# EAGLE design Deckelplatine v091 (EAGLE 7.2.0)
AUTHOR: Stefan Müller; DATABASE: /home/smueller/eagle/_parts-database.txt.csv; PARTNO: SMD-0603 2,2K; PROJEKTNAME: xMZ-Mod-Touch-Deckelplatine; REV: A; VERSION: 0.9.1
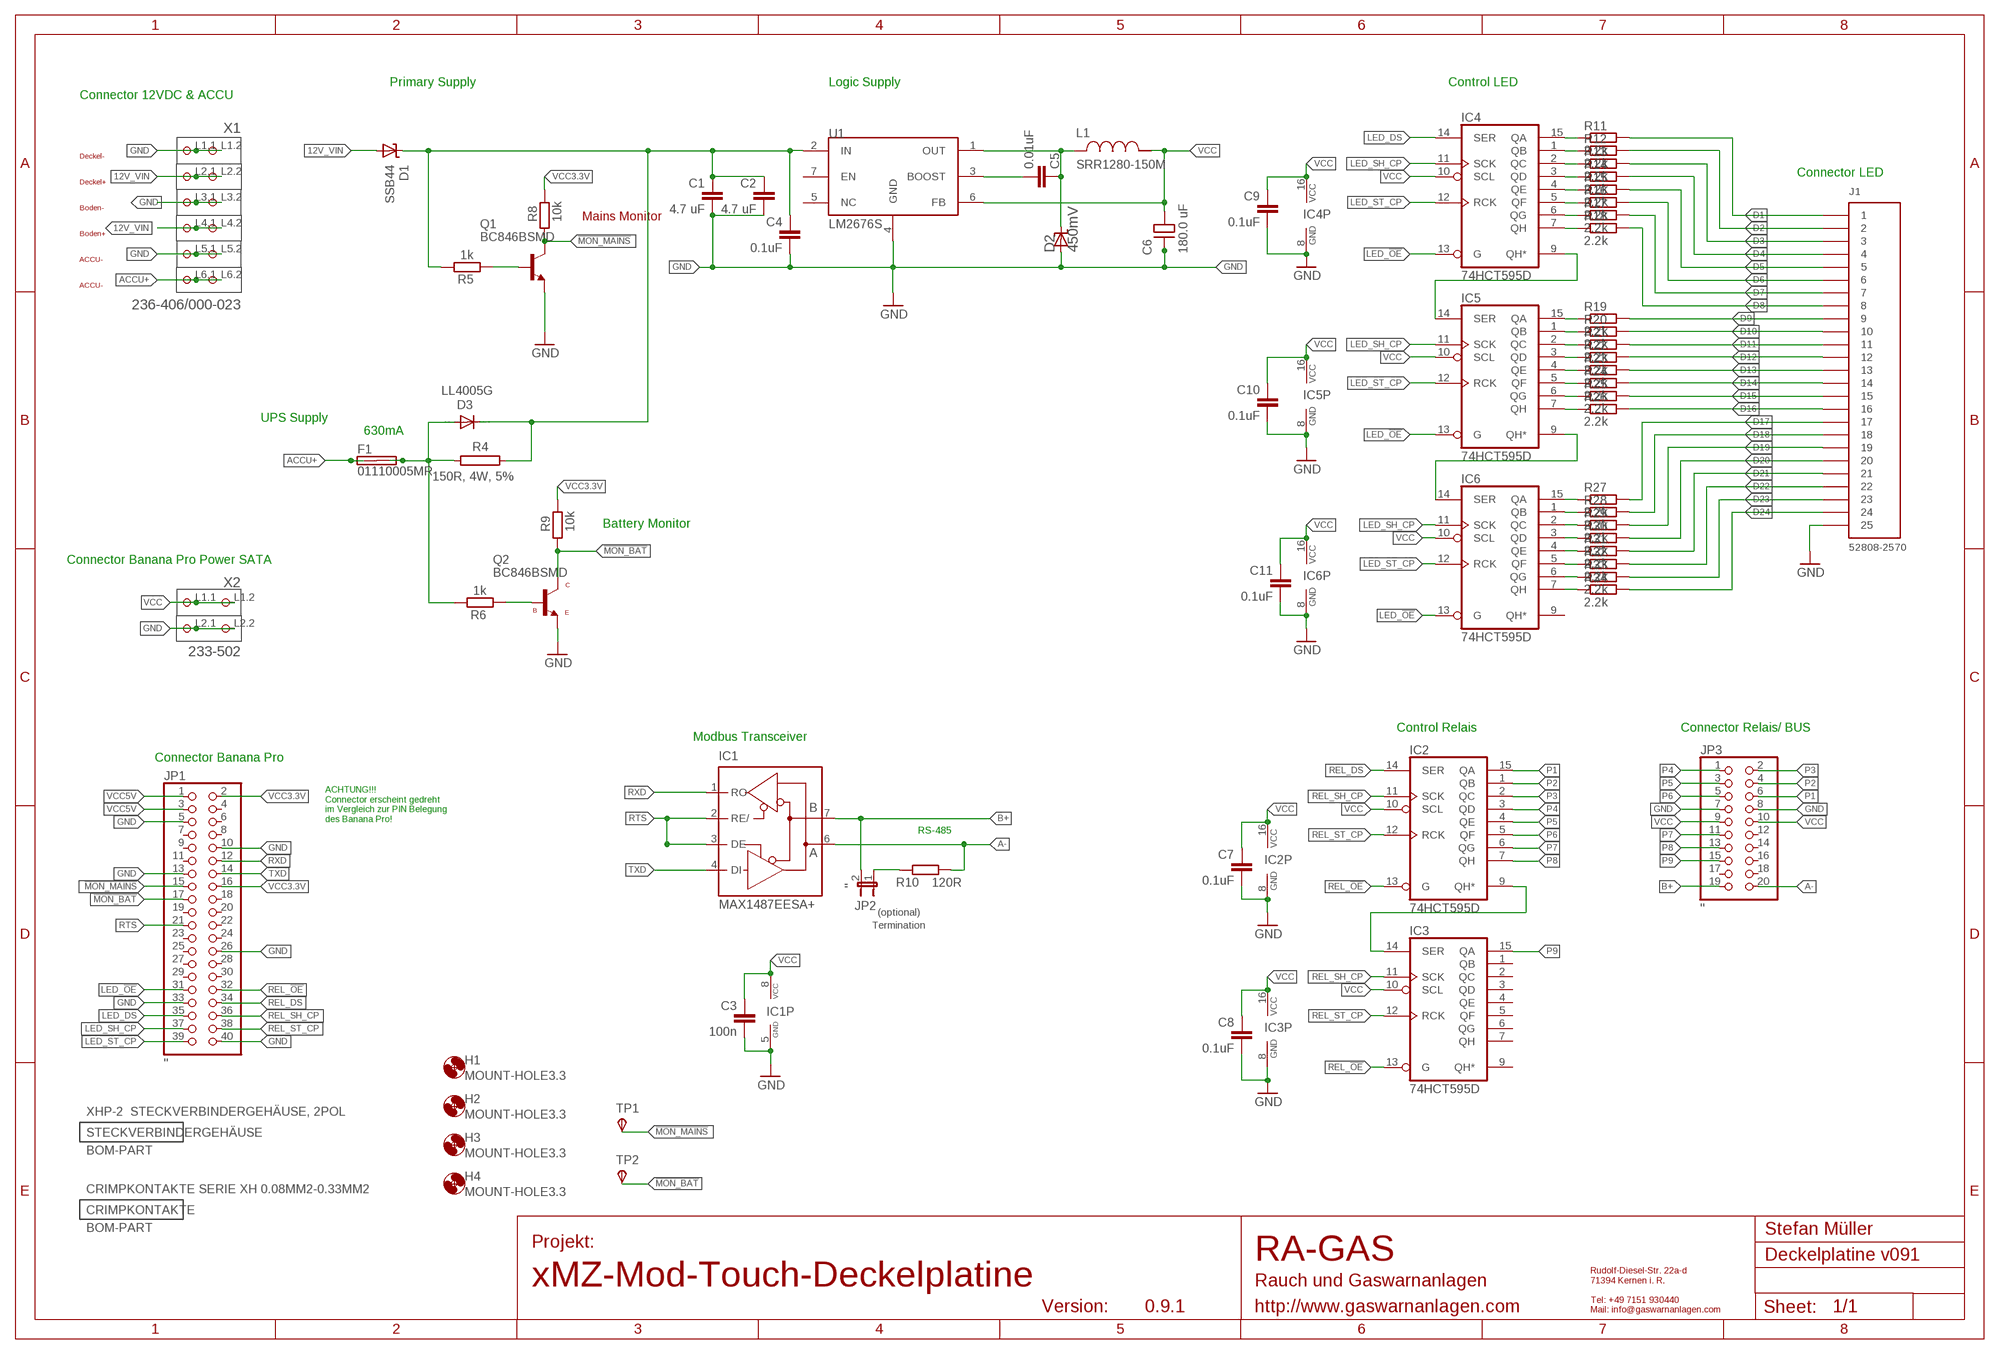
[diagram p0: schematic, sheet 1]
CRIMPKONTAKTE (BOM-PART): BOM: INCLUDE; DESC: CRIMPKONTAKTE SERIE XH 0.08MM2-0.33MM2; OC_FARNELL: 1516301; PARTNO: CRIMPKONTAKTE; QTY: 2
STECKVERBINDERGEHÄUSE (BOM-PART): BOM: INCLUDE; DESC: XHP-2 STECKVERBINDERGEHÄUSE, 2POL; OC_FARNELL: 1516264; PARTNO: 1516264; QTY: 1

## Parts
C1  4.7 uF  GRM21BR61E475MA12L  [GRM21BR61E475MA12L]
C2  4.7 uF  GRM21BR61E475MA12L  [GRM21BR61E475MA12L]
C3  100n  C-EUC0603  [C0603]
C4  0.1uF  08053C104KAT2A  [0805]
C5  0.01uF  GRM216R71H103KA01D  [GRM216R71H103KA01D]
C6  180.0 uF  16SVP180MSM_RADIAL_10MM  [SM_RADIAL_10MM]
C7  0.1uF  C-EUC0603  [C0603]
C8  0.1uF  C-EUC0603  [C0603]
C9  0.1uF  C-EUC0603  [C0603]
C10  0.1uF  C-EUC0603  [C0603]
C11  0.1uF  C-EUC0603  [C0603]
D1  SSB44  SUPPRESSOR-SMBJ  [SMBJ]
D2  450mV  B340LB-13-F  [SMB]
D3  LL4005G  DIODE-MELF-MLL41  [MELF-MLL41]
F1  01110005MR  [01110005MR]
H1  MOUNT-HOLE3.3  [3,3]
H2  MOUNT-HOLE3.3  [3,3]
H3  MOUNT-HOLE3.3  [3,3]
H4  MOUNT-HOLE3.3  [3,3]
IC1  MAX1487EESA+  MAX481CSA  [SO08]
IC2  74HCT595D  [SO16]
IC3  74HCT595D  [SO16]
IC4  74HCT595D  [SO16]
IC5  74HCT595D  [SO16]
IC6  74HCT595D  [SO16]
J1  52808-2570  [52808-2570]
JP1  ''  PINHD-2X20  [2X20]
JP2  ''  JP1E  [JP1]
JP3  ''  PINHD-2X10  [2X10]
L1  SRR1280-150M  [SRR1280]
Q1  BC846BSMD  [SOT23]
Q2  BC846BSMD  [SOT23]
R4  150R, 4W, 5%  RKH206-8  [KH206-8]
R5  1k  R-EU_R1210  [R1210]
R6  1k  R-EU_R1210  [R1210]
R8  10k  R-EU_R1210  [R1210]
R9  10k  R-EU_R1210  [R1210]
R10  120R  R-EU_R1206  [R1206]
R11  2.2k  R-EU_R0603  [R0603]
R12  2.2k  R-EU_R0603  [R0603]
R13  2.2k  R-EU_R0603  [R0603]
R14  2.2k  R-EU_R0603  [R0603]
R15  2.2k  R-EU_R0603  [R0603]
R16  2.2k  R-EU_R0603  [R0603]
R17  2.2k  R-EU_R0603  [R0603]
R18  2.2k  R-EU_R0603  [R0603]
R19  2.2k  R-EU_R0603  [R0603]
R20  2.2k  R-EU_R0603  [R0603]
R21  2.2k  R-EU_R0603  [R0603]
R22  2.2k  R-EU_R0603  [R0603]
R23  2.2k  R-EU_R0603  [R0603]
R24  2.2k  R-EU_R0603  [R0603]
R25  2.2k  R-EU_R0603  [R0603]
R26  2.2k  R-EU_R0603  [R0603]
R27  2.2k  R-EU_R0603  [R0603]
R28  2.2k  R-EU_R0603  [R0603]
R29  2.2k  R-EU_R0603  [R0603]
R30  2.2k  R-EU_R0603  [R0603]
R31  2.2k  R-EU_R0603  [R0603]
R32  2.2k  R-EU_R0603  [R0603]
R33  2.2k  R-EU_R0603  [R0603]
R34  2.2k  R-EU_R0603  [R0603]
TP1  TPSB1,27  [B1,27]
TP2  TPSB1,27  [B1,27]
U1  LM2676S  [TO-263-7]
X1  236-406/000-023  [P-236-406]
X2  233-502  [P-233-502]

## Nets
12V_VIN: C1.1 C2.1 C4.1 D1.A D1.C D3.C R4.2 R5.2 U1.2(IN) X1.L2.1(P2.1) X1.L2.2(P2.2) X1.L4.1(P4.1) X1.L4.2(P4.2)
!MON_BAT: JP1.17 Q2.3(C) R9.1 TP2.TP(PP)
!MON_MAINS: JP1.15 Q1.3(C) R8.1 TP1.TP(PP)
A-: IC1.6(A) JP3.20 R10.2
ACCU+: D3.A F1.1A F1.1B F1.2A F1.2B R4.1 R6.2 X1.L6.1(P6.1) X1.L6.2(P6.2)
B+: IC1.7(B) JP2.2 JP3.19
D1: J1.1 R11.2
D2: J1.2 R12.2
D3: J1.3 R13.2
D4: J1.4 R14.2
D5: J1.5 R15.2
D6: J1.6 R16.2
D7: J1.7 R17.2
D8: J1.8 R18.2
D9: J1.9 R19.2
D10: J1.10 R20.2
D11: J1.11 R21.2
D12: J1.12 R22.2
D13: J1.13 R23.2
D14: J1.14 R24.2
D15: J1.15 R25.2
D16: J1.16 R26.2
D17: J1.17 R27.2
D18: J1.18 R28.2
D19: J1.19 R29.2
D20: J1.20 R30.2
D21: J1.21 R31.2
D22: J1.22 R32.2
D23: J1.23 R33.2
D24: J1.24 R34.2
GND: C1.2 C2.2 C3.2 C4.2 C6.2(-) C7.2 C8.2 C9.2 C10.2 C11.2 D2.A IC1.5(GND) IC2.8(GND) IC3.8(GND) IC4.8(GND) IC5.8(GND) IC6.8(GND) J1.25 JP1.5 JP1.10 JP1.13 JP1.26 JP1.33 JP1.40 JP3.7 JP3.8 Q1.2(E) Q2.2(E) U1.4(GND) X1.L1.1(P1.1) X1.L1.2(P1.2) X1.L3.1(P3.1) X1.L3.2(P3.2) X1.L5.1(P5.1) X1.L5.2(P5.2) X2.L2.1(P2.1) X2.L2.2(P2.2)
LED_!OE: IC4.13(G) IC5.13(G) IC6.13(G) JP1.31
LED_DS: IC4.14(SER) JP1.35
LED_SH_CP: IC4.11(SCK) IC5.11(SCK) IC6.11(SCK) JP1.37
LED_ST_CP: IC4.12(RCK) IC5.12(RCK) IC6.12(RCK) JP1.39
N$2: IC5.9(QH*) IC6.14(SER)
N$3: IC2.9(QH*) IC3.14(SER)
N$4: Q2.1(B) R6.1
N$5: IC4.9(QH*) IC5.14(SER)
N$6: IC4.15(QA) R11.1
N$7: IC4.1(QB) R12.1
N$8: IC4.2(QC) R13.1
N$9: IC4.3(QD) R14.1
N$10: IC4.4(QE) R15.1
N$11: IC4.5(QF) R16.1
N$12: IC4.6(QG) R17.1
N$13: IC4.7(QH) R18.1
N$14: IC5.15(QA) R19.1
N$15: IC5.1(QB) R20.1
N$16: IC5.2(QC) R21.1
N$17: IC5.3(QD) R22.1
N$18: JP2.1 R10.1
N$19: IC5.4(QE) R23.1
N$20: IC5.5(QF) R24.1
N$21: IC5.6(QG) R25.1
N$22: IC5.7(QH) R26.1
N$23: IC6.15(QA) R27.1
N$24: IC6.1(QB) R28.1
N$25: IC6.2(QC) R29.1
N$26: IC6.3(QD) R30.1
N$27: IC6.4(QE) R31.1
N$28: IC6.5(QF) R32.1
N$29: IC6.6(QG) R33.1
N$30: IC6.7(QH) R34.1
N$37: Q1.1(B) R5.1
N$42: C5.2 U1.3(BOOST)
N$44: C5.1 D2.C L1.1 U1.1(OUT)
P1: IC2.15(QA) JP3.6
P2: IC2.1(QB) JP3.4
P3: IC2.2(QC) JP3.2
P4: IC2.3(QD) JP3.1
P5: IC2.4(QE) JP3.3
P6: IC2.5(QF) JP3.5
P7: IC2.6(QG) JP3.11
P8: IC2.7(QH) JP3.13
P9: IC3.15(QA) JP3.15
REL_!OE: IC2.13(G) IC3.13(G) JP1.32
REL_DS: IC2.14(SER) JP1.34
REL_SH_CP: IC2.11(SCK) IC3.11(SCK) JP1.36
REL_ST_CP: IC2.12(RCK) IC3.12(RCK) JP1.38
RTS: IC1.2(RE/) IC1.3(DE) JP1.21
RXD: IC1.1(RO) JP1.12
TXD: IC1.4(DI) JP1.14
VCC: C3.1 C6.1(+) C7.1 C8.1 C9.1 C10.1 C11.1 IC1.8(VCC) IC2.10(SCL) IC2.16(VCC) IC3.10(SCL) IC3.16(VCC) IC4.10(SCL) IC4.16(VCC) IC5.10(SCL) IC5.16(VCC) IC6.10(SCL) IC6.16(VCC) JP3.9 JP3.10 L1.2 U1.6(FB) X2.L1.1(P1.1) X2.L1.2(P1.2)
VCC3.3V: JP1.2 JP1.16 R8.2 R9.2
VCC5V: JP1.1 JP1.3
Unconnected: IC3.1(QB) IC3.2(QC) IC3.3(QD) IC3.4(QE) IC3.5(QF) IC3.6(QG) IC3.7(QH) IC3.9(QH*) IC6.9(QH*) JP1.4 JP1.6 JP1.7 JP1.8 JP1.9 JP1.11 JP1.18 JP1.19 JP1.20 JP1.22 JP1.23 JP1.24 JP1.25 JP1.27 JP1.28 JP1.29 JP1.30 JP3.12 JP3.14 JP3.16 JP3.17 JP3.18 U1.5(NC) U1.7(EN)

## Notes on the sheet
- Primary Supply | Logic Supply | Control LED
- Connector 12VDC & ACCU
- Deckel-
- Connector LED
- Deckel+
- Boden-
- Mains Monitor
- Boden+
- ACCU-
- ACCU-
- UPS Supply
- 630mA
- Battery Monitor
- Connector Banana Pro Power SATA
- C
- B
- E
- Control Relais | Connector Relais/ BUS
- Modbus Transceiver
- Connector Banana Pro
- ACHTUNG!!!
  Connector erscheint gedreht
  im Vergleich zur PIN Belegung 
  des Banana Pro!
- RS-485
- (optional)
- Termination

## Library data of the parts
C1 C2 = AcceleratedDesigns_Lib:GRM21BR61E475MA12L; CAP: 4.7E-6; DATASHEETURL: http://www.murata.com/products/catalog/pdf/c02e.pdf; ESR: 0.0020; IRMS: 7.29; MANUFACTURER_PART_NUMBER: GRM21BR61E475MA12L; MF: MURATA; MPN: GRM21BR61E475MA12L; OC_FARNELL: 2362111; VDC: 25.0; VENDOR: MuRata
C3 = resistor:C-EU: CAPACITOR, European symbol; MF: KEMET; MPN: C0603C104K8RACTU; OC_FARNELL: 2112833; PARTNO: ECHU-16-100N
C4 = AcceleratedDesigns_Lib:08053C104KAT2A; CAP: 1.0E-7; ESR: 0.28; IRMS: 0.0; MANUFACTURER_PART_NUMBER: 08053C104KAT2A; MF: AVX; MPN: 08053C104KAT2A; OC_FARNELL: 1740665; VDC: 25.0; VENDOR: AVX
C5 = AcceleratedDesigns_Lib:GRM216R71H103KA01D; CAP: 1.0E-8; ESR: 0.0; IRMS: 0.0; MANUFACTURER_PART_NUMBER: GRM216R71H103KA01D; MF: MURATA; MPN: GRM216R71H103KA01D; OC_FARNELL: 1828948; VDC: 50.0; VENDOR: MuRata
C6 = AcceleratedDesigns_Lib:16SVP180M; MF: PANASONIC ELECTRONIC COMPONENTS; MPN: 16SVP180MX; OC_FARNELL: 2354685; PARTNO: RAD FC 560/35
C7-C11 = resistor:C-EU: CAPACITOR, European symbol; MF: KEMET; MPN: C0603C104K8RACTU; OC_FARNELL: 2112833; PARTNO: SMD TAN.0,1/35
D1 = diode:SUPPRESSOR-: Suppressor diode; MF: VISHAY; MPN: SSB44-E3/52T; OC_FARNELL: 1336557
D2 = AcceleratedDesigns_Lib:B340LB-13-F; DATASHEETURL: http://www.diodes.com/datasheets/ds30240.pdf; IO: 3.0; MANUFACTURER_PART_NUMBER: B340LB-13-F; MF: DIODES INC.; MPN: B340LB-13-F; OC_FARNELL: 1843684; VENDOR: Diodes Inc.; VFATIO: 0.45; VRRM: 40.0
D3 = diode:DIODE-: DIODE; MF: TAIWAN SEMICONDUCTOR; MPN: LL4005G; OC_FARNELL: 1625106
F1 = fuse-littlefuse:01110005MR: Fuse Holder For 5mm Diameter Fuses Automatic Insertion Type From Littelfuse CatalogNumber: 0111 0005MR Farnell <http://de.farnell.com/webapp/wcs/stores/servlet/Search?catalogId=15001&langId=-3&storeId=10161&gs=true&st=0111%200005MR>; MF: LITTELFUSE; MPN: 01110005MR; OC_FARNELL: 1155771; OC_FARNELL_ALTERNATIVE: 01110005MR
H1-H4 = holes:MOUNT-HOLE: MOUNTING HOLE with drill center marker; OC_FARNELL: unknown
IC1 = maxim:MAX481CSA: RS485 TRANSEIVER; MF: MAXIM INTEGRATED PRODUCTS; MPN: MAX1487EESA+; OC_FARNELL: 1593310; OC_NEWARK: 90C3817; PARTNO: MAX481CSA
IC2-IC6 = RA-GAS Projekte LTD:74*595: 8-bit SHIFT REGISTER, output latch; MF: NXP; MPN: 74HCT595D; OC_FARNELL: 2098004; PARTNO: SMD HC 595
J1 = RA-GAS Projekte LTD:52808-2570: Molex 25pin header Series 52808. 1.00mm Pitch Easy-On™ Type FFC/FPC Connector, Surface Mount, Vertical, Non-ZIF Receptacle, 25 Circuits More Information here: http://www.molex.com/molex/products/datasheet.jsp?part=active/0528082570_FFC_FPC_CONNECTORS.xml Farnell Order Code (OC_FARNELL): 1757123 http://uk.farnell.com/molex/52808-2570/connector-fpc-1-0mm-25way/dp/1757123; MF: MOLEX; MPN: 52808-2570; OC_FARNELL: 1757123
JP1 = pinhead:PINHD-2X20: PIN HEADER; DNP: T; MF: HARWIN; MPN: M20-6112045; OC_FARNELL: 1569232; OC_FARNELL_ALTERNATIVE: 1569230
JP2 = jumper:JP1E: JUMPER; MF: TE CONNECTIVITY / AMP; MPN: 825433-2; OC_FARNELL: 3417645
JP3 = pinhead:PINHD-2X10: PIN HEADER; DNP: T; MF: TE CONNECTIVITY / AMP; MPN: 5103308-5; OC_FARNELL: 2452432; OC_FARNELL_ALTERNATIV: 9689621
L1 = AcceleratedDesigns_Lib:SRR1280-150M; DCR: 0.0285; IDC: 5.0; L: 1.5E-5; MANUFACTURER_PART_NUMBER: SRR1280-150M; MF: COILCRAFT; MPN: MSS1278-153MLD; OC_FARNELL: 2288501; VENDOR: Bourns
Q1 Q2 = transistor-npn:BC846*: NPN Transistor; MF: NXP; MPN: BC846,215; OC_FARNELL: 1081227
R4 = resistor-power:R: Power Resitor; MF: TE CONNECTIVITY / CGS; MPN: ER74150RJT; OC_FARNELL: 1751842; OC_FARNELL_ALTERNATIVE: 1219280; OC_NEWARK: unknown
R5 R6 = rcl:R-EU_: RESISTOR, European symbol; MF: PANASONIC ELECTRONIC COMPONENTS; MPN: ERJP14F1001U; OC_FARNELL: 1750918
R8 R9 = rcl:R-EU_: RESISTOR, European symbol; MF: PANASONIC ELECTRONIC COMPONENTS; MPN: ERJP14F1002U; OC_FARNELL: 1750931
R10 = rcl:R-EU_: RESISTOR, European symbol; MF: TE CONNECTIVITY; MPN: CRGH1206F120R; OC_FARNELL: 2332128
R11-R34 = RA-GAS Projekte LTD:R-EU_: RESISTOR, European symbol; MF: YAGEO (PHYCOMP); MPN: RC0603FR-072K2L; OC_FARNELL: 9238522; PARTNO: SMD-0603 2,2K
TP1 TP2 = testpad:TPS: TEST PIN; OC_FARNELL: unknown
U1 = NATIONAL SEMICONDUCTOR:LM2676: LM2676 SIMPLE SWITCHER ® High Efficiency 3A Step-Down Voltage Regulator The LM2676 series of regulators are monolithic integrated circuits which provide all of the active functions for a step- down (buck) switching regulator capable of driving up to 3A loads with excellent line and load regulation characteristics. High efficiency ( > 90%) is obtained through the use of a low ON-resistance DMOS power switch. The series consists of fixed output voltages of 3.3V, 5V and 12V and an adjustable output version. Reichelt.de <http://www.reichelt.de/ICs-LM-LS-/LM-2676-S5-0/3/index.html?ACTION=3&GROUPID=2912&ARTICLE=109378&START=0&OFFSET=16&> Datasheet <http://www.reichelt.de/index.html?&ACTION=7&LA=3&OPEN=0&INDEX=0&FILENAME=A200%252FDS_LM_2676.pdf>; MF: TEXAS INSTRUMENTS; MPN: LM2676S-5.0/NOPB; OC_FARNELL: 1564684
X1 = con-wago_236:236-406/000-023: Stand: 01.01.2014. Die jeweils aktuellen Daten zu diesem Artikel finden Sie in unserem Produktkatalog, den Sie unter www.wago.com einsehen können. As of: 01/01/2014. Please find the newest data for this article in our product catalogue, which can be viewed under www.wago.com.; MF: WAGO; MPN: 236-406; OC_FARNELL: 1283529
X2 = con-wago_233:233-502: Serie 233, Klemmenleiste für Leiterplatten 2 Lötstifte/Pol / Series 233, PCB terminal strip 2 solder pins/pole Polzahl / Pole No.: 2 Rastermaß / Pitch: 2.54 - 2.54 mm Bemessungsspannung / Rated Voltage: 160 V Nennstrom / Nominal Current: 6 A Leiterquerschnitt / Conductor Size: 0.08 - 0.5 mm2 Anschlusstechnik / Connection Technology: CAGE CLAMP® Lötstiftlänge: / Solder Pin Length: 4 mm Leitereinführung (zur Platine) / Conductor entry angle (to PCB): 30 ° Farbe / Color: orange / orange Stand: 01.01.2014. Die jeweils aktuellen Daten zu diesem Artikel finden Sie in unserem Produktkatalog, den Sie unter www.wago.com einsehen können. As of: 01/01/2014. Please find the newest data for this article in our product catalogue, which can be viewed under www.wago.com.; MF: WAGO; MPN: 233-502.; OC_FARNELL: 1777096

## Board
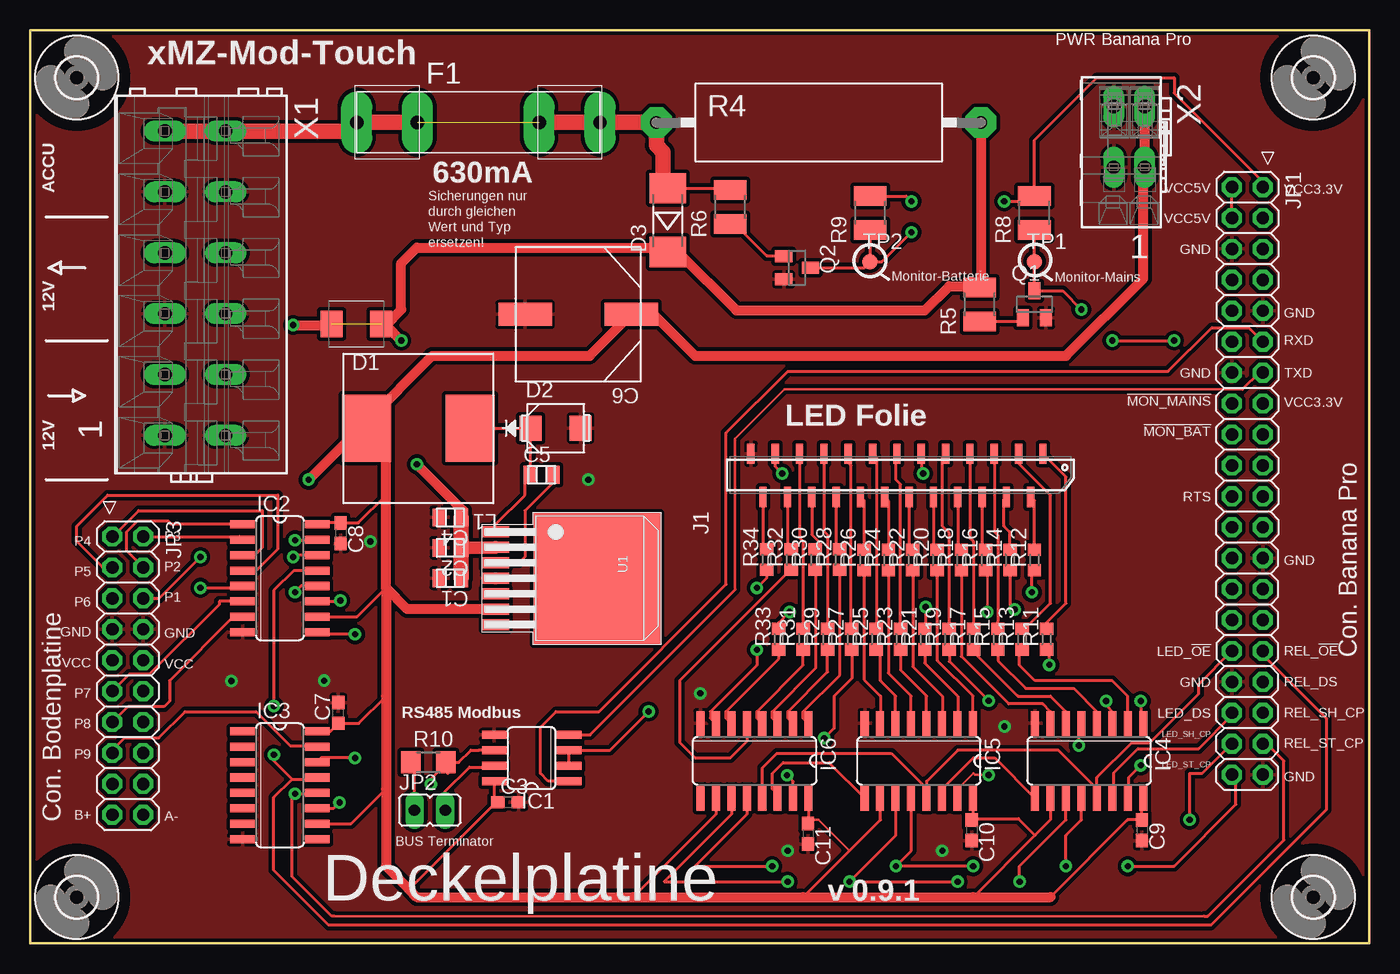
[diagram p1: board, top side]
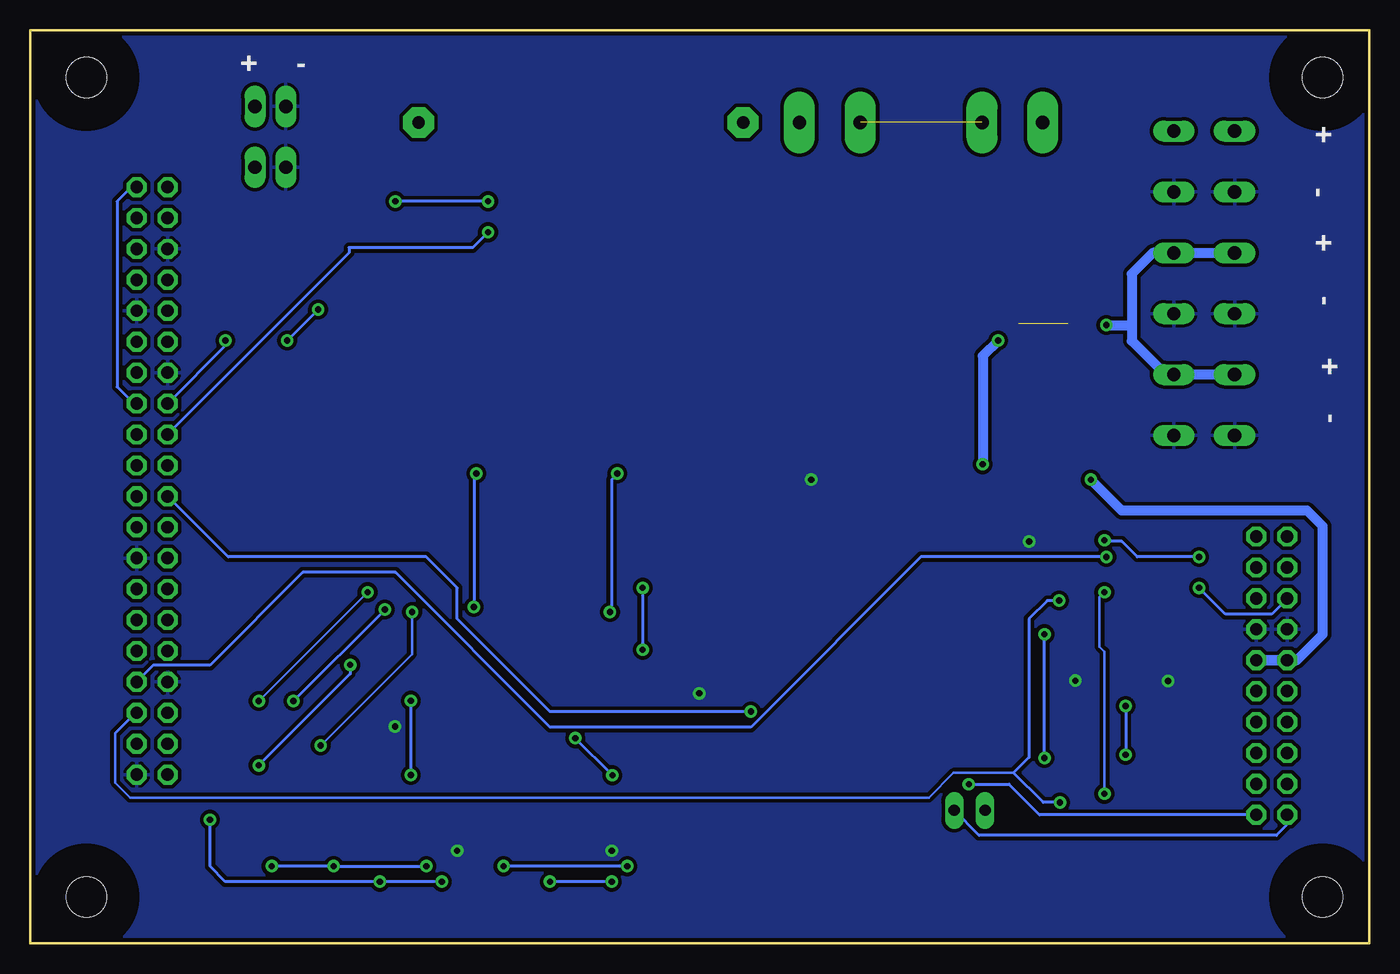
[diagram p2: board, bottom side, seen from below]

Size 110 x 75 mm. Coordinates in mm from the lower left corner, seen from the top.
Outline: 110,0 0,0 0,75 110,75 110,0.07
Copper layers (1*16): Top 0.035mm / dielectric 1.5mm / Bottom 0.035mm
Design rules "SparkFun": minimum track width 8mil, minimum drill 20mil, track to track 8mil, track to pad 8mil, pad to pad 8mil, via to via 8mil, smd to smd 8mil, copper to edge 8mil, drill to drill 8mil, minimum pad ring 12mil, minimum via ring 10mil, stop-mask expansion 4mil, vias tented up to drill 20mil, thermal gap 10mil

### Footprints (pad centres in the part's own frame; a part is rotated, then mirrored left to right if it is on the bottom)
GRM21BR61E475MA12L = smd 1.118 x 1.448: 1 -0.902,0; 2 0.902,0
C0603 = smd 1.1 x 1: 1 -0.85,0; 2 0.85,0
0805 = smd 1.118 x 1.448: 1 -0.902,0; 2 0.902,0
GRM216R71H103KA01D = smd 1.118 x 1.448: 1 -0.902,0; 2 0.902,0
SM_RADIAL_10MM = smd 4.4 x 1.9: 1 -4.35,0; 2 4.35,0
SMBJ = smd 1.78 x 2.16: A 2.04,0; C -2.03,0
SMB = smd 1.803 x 2.057: A 2.045,0; C -2.045,0
MELF-MLL41 = smd 2.5 x 3: A 2.625,0; C -2.625,0
01110005MR = drill 1.1 pad 2.54 long: 1A -10,0; 1B -5,0; 2A 10,0; 2B 5,0
3,3 = hole 3.3: 0,0
SO08 = smd 0.66 x 2.032: 1 -1.905,-3.073; 2 -0.635,-3.073; 3 0.635,-3.073; 4 1.905,-3.073; 5 1.905,3.073; 6 0.635,3.073; 7 -0.635,3.073; 8 -1.905,3.073
SO16 = smd 0.66 x 2.032: 1 -4.445,-3.073; 2 -3.175,-3.073; 3 -1.905,-3.073; 4 -0.635,-3.073; 5 0.635,-3.073; 6 1.905,-3.073; 7 3.175,-3.073; 8 4.445,-3.073; 9 4.445,3.073; 10 3.175,3.073; 11 1.905,3.073; 12 0.635,3.073; 13 -0.635,3.073; 14 -1.905,3.073; 15 -3.175,3.073; 16 -4.445,3.073
52808-2570 = smd 1.65 x 0.6: 1 -1.725,11.7; 2 1.825,10.7; 3 -1.725,9.7; 4 1.825,8.7; 5 -1.725,7.7; 6 1.825,6.7; 7 -1.725,5.7; 8 1.825,4.7; 9 -1.725,3.7; 10 1.825,2.7; 11 -1.725,1.7; 12 1.825,0.7; 13 -1.725,-0.3; 14 1.825,-1.3; 15 -1.725,-2.3; 16 1.825,-3.3; 17 -1.725,-4.3; 18 1.825,-5.3; 19 -1.725,-6.3; 20 1.825,-7.3; 21 -1.725,-8.3; 22 1.825,-9.3; 23 -1.725,-10.3; 24 1.825,-11.3; 25 -1.725,-12.3
2X20 = drill 1.016 octagon: 1 -24.13,-1.27; 2 -24.13,1.27; 3 -21.59,-1.27; 4 -21.59,1.27; 5 -19.05,-1.27; 6 -19.05,1.27; 7 -16.51,-1.27; 8 -16.51,1.27; 9 -13.97,-1.27; 10 -13.97,1.27; 11 -11.43,-1.27; 12 -11.43,1.27; 13 -8.89,-1.27; 14 -8.89,1.27; 15 -6.35,-1.27; 16 -6.35,1.27; 17 -3.81,-1.27; 18 -3.81,1.27; 19 -1.27,-1.27; 20 -1.27,1.27; 21 1.27,-1.27; 22 1.27,1.27; 23 3.81,-1.27; 24 3.81,1.27; 25 6.35,-1.27; 26 6.35,1.27; 27 8.89,-1.27; 28 8.89,1.27; 29 11.43,-1.27; 30 11.43,1.27; 31 13.97,-1.27; 32 13.97,1.27; 33 16.51,-1.27; 34 16.51,1.27; 35 19.05,-1.27; 36 19.05,1.27; 37 21.59,-1.27; 38 21.59,1.27; 39 24.13,-1.27; 40 24.13,1.27
JP1 = drill 0.914 long: 1 0,-1.27; 2 0,1.27
2X10 = drill 1.016 octagon: 1 -11.43,-1.27; 2 -11.43,1.27; 3 -8.89,-1.27; 4 -8.89,1.27; 5 -6.35,-1.27; 6 -6.35,1.27; 7 -3.81,-1.27; 8 -3.81,1.27; 9 -1.27,-1.27; 10 -1.27,1.27; 11 1.27,-1.27; 12 1.27,1.27; 13 3.81,-1.27; 14 3.81,1.27; 15 6.35,-1.27; 16 6.35,1.27; 17 8.89,-1.27; 18 8.89,1.27; 19 11.43,-1.27; 20 11.43,1.27
SRR1280 = smd 4 x 5.5: 1 -4.25,0; 2 4.25,0
SOT23 = smd 1 x 1.4: 1 -0.95,-1.1; 2 0.95,-1.1; 3 0,1.1
KH206-8 = drill 1.016 pad 2.54 octagon: 1 -13.335,0; 2 13.335,0
R1210 = smd 1.6 x 2.7: 1 -1.4,0; 2 1.4,0
R1206 = smd 1.6 x 1.803: 1 -1.422,0; 2 1.422,0
R0603 = smd 1 x 1.1: 1 -0.85,0; 2 0.85,0
B1,27 = smd 1.27 x 1.27: TP 0,0
TO-263-7 = smd 2.16 x 0.92: 1 8.76,-3.81; 2 8.76,-2.54; 3 8.76,-1.27; 4 8.76,0; 5 8.76,1.27; 6 8.76,2.54; 7 8.76,3.81 | smd 10.4 x 10.8: TAP 0.44,0
P-236-406 = drill 1.1 long: L1.1 2.957,12.35; L1.2 -2.043,12.35; L2.1 2.957,7.35; L2.2 -2.043,7.35; L3.1 2.957,2.35; L3.2 -2.043,2.35; L4.1 2.957,-2.65; L4.2 -2.043,-2.65; L5.1 2.957,-7.65; L5.2 -2.043,-7.65; L6.1 2.957,-12.65; L6.2 -2.043,-12.65
P-233-502 = drill 1.1 long: L1.1 1.238,1.55; L1.2 -3.762,1.55; L2.1 1.238,-0.99; L2.2 -3.762,-0.99

### Placement (x,y rotation side)
C1  34.5,30 180 top
C2  34.5,32.5 180 top
C3  39.25,11.61 0 top
C4  34.5,35 180 top
C5  42,38.5 0 top
C6  45.01,51.67 180 top
C7  25.3,18.94 90 top
C8  25.5,33.7 270 top
C9  91.34,9.3 270 top
C10  77.34,9.3 270 top
C11  63.88,9.02 270 top
D1  26.78,50.89 180 top
D2  43.16,42.33 0 top
D3  52.36,59.41 90 top
F1  36.81,67.45 0 top
H1  3.81,3.81 0 top
H2  3.81,71.12 0 top
H3  105.41,71.12 0 top
H4  105.41,3.81 0 top
IC1  41.18,15.23 90 top
IC2  20.5,30 270 top
IC3  20.5,13 270 top
IC4  87,15 180 top
IC5  73,15 180 top
IC6  59.5,15 180 top
J1  71.5,38.5 270 top
JP1  100,38 270 top
JP2  32.82,10.93 270 top
JP3  8,22 270 top
L1  31.88,42.31 180 top
Q1  82.5,52.5 0 top
Q2  63,55.5 270 top
R4  64.77,67.44 0 top
R5  78,52.5 90 top
R6  57.5,60.5 90 top
R8  82.5,60 90 top
R9  69,60 90 top
R10  32.7,14.87 0 top
R11  83.5,25 90 top
R12  82.5,31.5 90 top
R13  81.5,25 90 top
R14  80.5,31.5 90 top
R15  79.5,25 90 top
R16  78.5,31.5 90 top
R17  77.5,25 90 top
R18  76.5,31.5 90 top
R19  75.5,25 90 top
R20  74.5,31.5 90 top
R21  73.5,25 90 top
R22  72.5,31.5 90 top
R23  71.5,25 90 top
R24  70.5,31.5 90 top
R25  69.5,25 90 top
R26  68.5,31.5 90 top
R27  67.5,25 90 top
R28  66.5,31.54 90 top
R29  65.5,25 90 top
R30  64.5,31.54 90 top
R31  63.5,25 90 top
R32  62.5,31.54 90 top
R33  61.5,25 90 top
R34  60.5,31.54 90 top
TP1  82.5,56 0 top
TP2  69,56 0 top
U1  47,30 180 top
X1  14,54.08 180 top
X2  90,65 270 top

### Tracks (layer width: path | path; a pad name or v marks a point on that pad's centre or on a via)
12V_VIN  (via drill 0.51)  (1 unrouted)
  Top 0.254: 24.65,50.8 D1.A
  Top 0.813: R4.2 78.11,54.01 | 53.21,56.79 58,52 73.5,52 75.5,54 78,54 | 29.12,50.71 29.21,50.8 | 29.21,50.8 30.48,52.07 30.48,55.88 31.75,57.15 52,57.15 D3.C | D1.C 29.12,50.89 29.21,50.8 | 29.21,50.8 v30.48,49.53 | v31.75,39.37 35.56,35.56 35.56,35.16 C4.1 | v21.59,50.8 24.65,50.8
  Top 1.016: C2.1 38.2,32.5 U1.2
  Top 1.27: 78.11,54.01 78.05,53.95 | 78.05,53.95 R5.2 | D3.C 53.21,56.79 | 78,54 78.05,53.95 | C4.1 C2.1 C1.1
  Bottom 0.813: X1.L2.1 16,46.73 | 16,46.73 X1.L2.2 | v30.48,49.53 31.75,48.26 v31.75,39.37 | X1.L4.1 X1.L4.2 17.77,56.73 19.5,55 19.5,50.8 | 19.5,50.8 19.5,49.5 16.5,46.5 16.23,46.5 16,46.73 | v21.59,50.8 19.5,50.8
!MON_BAT  (via drill 0.51)
  Top 0.254: Q2.3 68.5,55.5 68.73,55.73 TP2.TP | TP2.TP 69.97,56 v72.39,58.42 | R9.1 TP2.TP
  Bottom 0.254: v72.39,58.42 73.66,57.15 83.82,57.15 83.82,56.72 JP1.17
!MON_MAINS  (via drill 0.51)
  Top 0.254: R8.1 TP1.TP Q1.3 84.83,53.6 v86.36,52.07 | v88.9,49.53 v93.98,49.53
  Bottom 0.254: v86.36,52.07 v88.9,49.53 | v93.98,49.53 93.98,49.1 JP1.15
A-  (via drill 0.51)
  Top 0.254: 34.29,13.97 34.29,14.7 R10.2 34.29,14.87 | 34.29,14.87 35.19,14.87 36.2,15.88 36.83,15.88 36.84,15.87 IC1.6 | v32.89,13.08 32.89,13.47 34.29,14.87
  Bottom 0.254: JP3.20 27.08,10.57 29.59,13.08 v32.89,13.08
ACCU+  (1 unrouted)
  Top 0.254: D3.A 57.46,62.04 57.5,62 R6.2
  Top 1.27: F1.1B F1.1A 26.09,66.73 X1.L6.2 X1.L6.1 | F1.2B F1.2A R4.1 51.44,65.56 52,65 52,62.4 D3.A
B+
  Top 0.254: JP2.2 34.09,12.5 36.07,14.48 37.99,14.48 IC1.7
  Bottom 0.254: JP3.19 6.73,9.78 7.62,8.89 32.05,8.89 JP2.2
D1
  Top 0.254: R11.2 83.5,26.35 85.09,27.94 85.09,38.34 J1.1
D2
  Top 0.254: R12.2 82.5,36.38 J1.2
D3
  Top 0.254: R13.2 81.73,25.85 83.82,27.94 83.82,36.83 81.2,39.45 J1.3
D4
  Top 0.254: R14.2 80.5,33.8 80.01,34.29 80.01,36.48 J1.4
D5
  Top 0.254: J1.5 79.2,33.83 79.5,33.53 79.5,26.49 79.5,26.48 R15.2
D6
  Top 0.254: J1.6 78.2,32.65 R16.2
D7
  Top 0.254: J1.7 77.2,33.29 77.47,33.02 77.47,25.88 R17.2
D8
  Top 0.254: J1.8 76.2,32.65 R18.2
D9
  Top 0.254: R19.2 75.5,33.72 74.93,34.29 74.93,39.95 J1.9
D10
  Top 0.254: J1.10 74.2,32.65 R20.2
D11  (via drill 0.51)
  Top 0.254: J1.11 73.2,38.76 v73.36,38.61 | v73.56,27.64 73.56,25.91 R21.2
  Bottom 0.203: v73.36,38.61 73.56,38.41
  Bottom 0.254: 73.56,38.41 v73.56,27.64
D12
  Top 0.254: J1.12 72.2,32.65 R22.2
D13
  Top 0.254: R23.2 71.5,37.72 71.12,38.1 71.12,40.15 J1.13
D14
  Top 0.254: J1.14 70.5,36.38 R24.2
D15
  Top 0.254: J1.15 69.5,39.92 R25.2
D16
  Top 0.254: J1.16 68.5,36.38 R26.2
D17
  Top 0.254: R27.2 67.44,25.91 67.44,39.24 67.2,39.48 J1.17
D18
  Top 0.254: J1.18 66.2,32.69 R28.2
D19
  Top 0.254: J1.19 65.2,33.86 65.48,33.58 65.48,25.87 R29.2
D20
  Top 0.254: J1.20 64.2,33.59 64.77,33.02 64.77,32.66 R30.2
D21
  Top 0.254: J1.21 63.2,33.32 63.5,33.02 R31.2
D22
  Top 0.254: J1.22 62.2,32.69 R32.2
D23  (via drill 0.51)
  Top 0.254: R33.2 61.5,26.35 v62.38,27.23 | J1.23 61.2,39.18 v61.77,38.61
  Bottom 0.254: v61.77,38.61 61.77,38.56 62.23,38.1 62.23,27.38 v62.38,27.23
D24
  Top 0.254: J1.24 60.2,32.69 R34.2
GND  (via drill 0.51)
  other vias: 62.23,7.62 74.93,7.62 24.13,21.59 55.04,20.55 27.94,33.02 45.85,38.1 80.04,17.82 16.52,21.56
  pour Top (isolate 0.305): 110,75 110,0 0,0 0,75
  pour Bottom (isolate 0.305): 110,75 110,0 0,0 0,75
LED_!OE
  Top 0.254: JP1.31 96,21.3 96,20.5 92,16.5 90.5,16.5 87.64,13.63 IC4.13 87.64,12.7 84.45,15.88 76.2,15.88 73.66,13.34 73.66,12.7 | 73.66,12.7 73.66,11.95 IC5.13 | IC6.13 60.13,14.41 61.34,15.62 70.74,15.62 73.66,12.7
LED_DS
  Top 0.254: JP1.35 98.73,18.73 96,16 91,16 89,14 89,12.02 IC4.14
LED_SH_CP  (via drill 0.51)
  Top 0.254: 71.09,12.72 IC5.11 71.12,11.9 71.12,8.89 v67.31,5.08 v76.2,5.08 | 57.59,12.76 IC6.11 57.59,10.61 52.07,5.08 v62.23,5.08 | v95.25,10.16 95.25,13.97 96.29,13.97 JP1.37 | v81.28,5.08 81.28,6.35 85.09,10.16 IC4.11
  Bottom 0.254: v62.23,5.08 v67.31,5.08 | v76.2,5.08 v81.28,5.08 93.98,5.08 95.25,6.35 v95.25,10.16
LED_ST_CP  (via drill 0.51)
  Top 0.254: IC6.12 58.87,10.61 54.61,6.35 v60.96,6.35 | IC5.12 72.39,11.9 72.39,7.62 v71.12,6.35 v77.47,6.35 | v90.17,6.35 93.98,6.35 99.06,11.43 99.06,13.54 JP1.39 | v85.09,6.35 85.09,8.89 86.36,10.16 IC4.12
  Bottom 0.254: v60.96,6.35 v71.12,6.35 | v77.47,6.35 v85.09,6.35 v90.17,6.35
N$2
  Top 0.254: IC6.14 61.41,12.26 60.96,12.7 60.96,13.97 61.85,14.86 65.62,14.86 IC5.9
N$3  (via drill 0.51)
  Top 0.254: v26.67,15.24 23.91,15.24 IC3.14 | v26.67,25.4 23.73,25.4 IC2.9
  Bottom 0.254: v26.67,15.24 v26.67,25.4
N$4
  Top 0.254: R6.1 57.9,59.1 60.5,56.5 61.85,56.5 Q2.1
N$5
  Top 0.254: IC5.14 74.91,12.68 77.47,15.24 79.24,15.24 IC4.9
N$6  (via drill 0.51)
  Top 0.254: v83.72,22.89 83.72,23.93 R11.1 | IC4.15 90.22,11.97 90.22,13.61 v91.24,14.63
  Bottom 0.254: v91.24,14.63 83.72,22.15 v83.72,22.89
N$7  (via drill 0.51)
  Top 0.254: v82.3,28.85 82.3,30.45 R12.1 | v91.24,19.91 91.24,18.28 IC4.1
  Bottom 0.203: v91.24,19.91 v82.3,28.85
N$8
  Top 0.254: IC4.2 90.17,20.32 88.9,21.59 82.55,21.59 81.28,22.86 81.28,23.93 R13.1
N$9  (via drill 0.51)
  Top 0.254: R14.1 80.5,27.81 v80.87,27.43 | v88.39,19.91 88.39,19.56 88.9,19.05 IC4.3
  Bottom 0.254: v88.39,19.91 v80.87,27.43
N$10
  Top 0.254: R15.1 79.5,23.24 81.79,20.95 85.72,20.95 87.63,19.05 IC4.4
N$11  (via drill 0.51)
  Top 0.203: v78.64,27.23 78.64,30.48
  Top 0.254: 78.64,30.48 78.64,30.51 R16.1 | v86.16,16.26 86.16,17.86 IC4.5
  Bottom 0.203: v78.64,27.23 78.64,23.77 v86.16,16.26
N$12
  Top 0.254: IC4.6 85.09,19.05 83.82,20.32 81.15,20.32 77.5,23.97 R17.1
N$13
  Top 0.254: R18.1 76.5,23.58 80.39,19.68 83.19,19.68 83.83,19.05 IC4.7
N$14  (via drill 0.51)
  Top 0.203: 76.2,12.7 77.47,13.97 77.6,13.84 v78.74,13.84
  Top 0.254: R19.1 75.5,23.18 v78.74,19.94 | IC5.15 76.2,11.95 76.2,12.7
  Bottom 0.254: v78.74,19.94 v78.74,13.84
N$15
  Top 0.254: IC5.1 77.44,20.3 77.47,20.32 74.55,23.24 74.55,30.6 R20.1
N$16
  Top 0.254: R21.1 73.5,23.02 76.2,20.32 76.2,18.1 IC5.2
N$17
  Top 0.254: R22.1 72.5,22.75 74.93,20.32 74.93,18.1 IC5.3
N$18
  Top 0.254: JP2.1 31.55,14.6 R10.1
N$19
  Top 0.254: R23.1 71.5,22.48 73.66,20.32 73.64,20.3 IC5.4
N$20
  Top 0.254: IC5.5 72.36,20.3 72.39,20.32 70.5,22.21 R24.1
N$21
  Top 0.254: IC5.6 71.09,20.3 71.12,20.32 69.85,21.59 69.85,23.8 R25.1
N$22
  Top 0.254: R26.1 68.5,21.67 69.85,20.32 69.85,18.1 IC5.7
N$23  (via drill 0.51)
  Top 0.254: R27.1 67.5,21.78 66.04,20.32 66.04,17.68 v65.23,16.87 | IC6.15 62.67,13.32 v62.18,13.82
  Bottom 0.254: v62.18,13.82 v65.23,16.87
N$24
  Top 0.254: IC6.1 63.5,18.52 63.5,19.05 66.5,22.05 R28.1
N$25
  Top 0.254: IC6.2 62.23,18.52 62.23,19.05 65.5,22.32 R29.1
N$26
  Top 0.254: R30.1 64.5,22.59 60.96,19.05 60.96,18.52 IC6.3
N$27
  Top 0.254: IC6.4 59.69,18.52 59.69,19.05 63.5,22.86 R31.1
N$28
  Top 0.254: IC6.5 58.87,16.6 57.51,15.24 54.61,15.24 53.34,16.51 53.34,21.59 62.44,30.69 R32.1
N$29
  Top 0.254: IC6.6 57.15,18.52 57.15,19.05 61.5,23.4 R33.1
N$30  (via drill 0.51)
  Top 0.254: R34.1 60.5,30.02 v59.69,29.21 | v59.69,24.13 59.69,22.86 55.88,19.05 55.88,18.52 IC6.7
  Bottom 0.254: v59.69,29.21 v59.69,24.13
N$37
  Top 0.254: Q1.1 81.25,51.1 R5.1
N$42
  Top 0.254: C5.2 42.9,37.82 40.64,35.56 40.64,31.75 40.16,31.27 U1.3
N$44
  Top 0.254: L1.1 40.64,42.31 | 40.64,42.31 41.09,42.31 D2.C | U1.1 38.24,34.43 40.64,36.83 40.64,38.04 C5.1 41.1,41.85 40.64,42.31
P1  (via drill 0.51)
  Top 0.254: v21.74,33.12 23.52,33.12 IC2.15 | JP3.6 10.57,28.35 v13.97,31.75
  Bottom 0.254: v13.97,31.75 19.05,31.75 20.32,33.02 21.64,33.02 v21.74,33.12
P2
  Top 0.254: IC2.1 11.59,34.45 11.36,34.67 8.76,34.67 7.87,33.78 7.87,32.29 JP3.4
P3
  Top 0.254: JP3.2 17.17,33.43 IC2.2
P4
  Top 0.254: JP3.1 6.76,33.43 8.89,35.56 19.05,35.56 19.05,32.51 18.29,31.75 18.16,31.75 18.01,31.91 IC2.3
P5
  Top 0.254: JP3.3 5.94,30.89 3.81,33.02 3.81,34.29 6.35,36.83 20.32,36.83 20.32,32.38 18.41,30.48 17.58,30.48 IC2.4
P6  (via drill 0.51)
  Top 0.254: v13.97,29.21 17.27,29.21 IC2.5
  Bottom 0.254: v13.97,29.21 11.81,27.05 8,27.05 6.73,28.32 JP3.5
P7
  Top 0.254: IC2.6 15.52,28.09 15.52,27.84 9.78,22.1 8.1,22.1 JP3.11
P8
  Top 0.254: IC2.7 16.66,26.82 11.43,21.59 11.43,19.91 10.97,19.46 8,19.46 JP3.13
P9
  Top 0.254: IC3.15 23.49,16.26 21.34,16.26 18.54,19.05 12.7,19.05 10.54,16.89 7.75,16.89 6.73,15.87 JP3.15
REL_!OE  (via drill 0.51)
  Top 0.254: JP1.32 101.27,23.73 106.5,18.5 106.5,11 97,1.5 24.5,1.5 20,6 20,12 21.5,13.5 | 21.5,13.5 23.44,13.5 IC3.13 | IC2.13 21.64,30.64 20,29 v20,19.5 | v20,15.5 20,15 21.5,13.5
  Bottom 0.254: v20,19.5 v20,15.5
REL_DS  (via drill 0.51)
  Top 0.254: IC2.14 21.75,31.91 v21.59,31.75
  Bottom 0.254: v21.59,31.75 36.83,31.75 50.8,17.78 67.31,17.78 80.01,30.48 87.63,30.48 95.25,22.86 99.9,22.86 JP1.34
REL_SH_CP  (via drill 0.51)
  Top 0.254: IC2.11 25.4,28.09 v25.48,28.17 | IC3.11 24.91,11.1 v25.4,11.58
  Bottom 0.203: 103.02,17.27 103.02,13.21 101.8,11.99 36.17,11.99 34.14,14.02 29.21,14.02
  Bottom 0.254: JP1.36 101.34,18.95 103.02,17.27 | v25.48,28.17 26.44,28.17 27.94,26.67 27.94,15.29 29.21,14.02 26.77,11.58 v25.4,11.58
REL_ST_CP  (via drill 0.51)
  Top 0.203: 24.96,2.25 96.44,2.25
  Top 0.254: 24.96,2.25 24.75,2.25 21.5,5.5 21.5,12.06 v21.74,12.3 23.51,12.3 IC3.12 | 96.44,2.25 96.75,2.25 103,8.5 103,15 101.59,16.41 JP1.38 | IC2.12 22.25,29.36 v21.74,28.85
  Bottom 0.203: v21.74,12.3 21.74,23.98 22.15,24.38 22.15,28.45 v21.74,28.85
RTS  (via drill 0.51)
  Top 0.254: IC1.2 IC1.3 47.62,15.87 v50.8,19.05
  Bottom 0.254: v50.8,19.05 67.31,19.05 74.93,26.67 74.93,29.21 77.47,31.75 93.75,31.75 JP1.21
RXD
  Top 0.254: JP1.12 100.1,50.6 97.08,50.6 93.47,46.99 62.23,46.99 57.17,41.94 57.17,29.49 46.74,19.05 43.18,19.05 41.91,17.78 41.91,13.97 42.55,13.33 IC1.1
TXD
  Top 0.203: 57.91,29.06 57.91,41.45 61.98,45.52 99.59,45.52
  Top 0.254: JP1.14 100.97,46.89 99.59,45.52 | 57.91,29.06 45.99,17.14 IC1.4
VCC  (via drill 0.51)
  Top 0.203: 63.95,9.71 63.95,10.16 64.77,10.16 67.31,7.62
  Top 0.254: IC2.16 23.68,34.55 C8.1 26.93,34.55 29.21,36.83 | IC4.16 91.34,11.82 C9.1 90.16,10.15 83.82,3.81 | L1.2 27.63,42.87 | C6.1 51.2,51.67 | 91.44,63.65 X2.L1.1 | IC5.10 69.85,11.9 69.85,10.16 67.31,7.62 63.5,3.81 | IC6.10 56.33,10.61 49.53,3.81 | IC1.8 38.11,11.9 C3.1 38.28,11.61 31.11,4.45 | IC3.10 26.34,9.82 29.21,12.7 | IC2.10 26.82,26.82 29.21,29.21 | 82.55,8.89 83.83,10.16 IC4.10 | 82.55,8.89 77.47,3.81 | IC5.16 77.44,10.25 | 77.44,10.25 C10.1 | IC6.16 63.95,10.16 63.95,9.93 C11.1 | 77.44,10.25 81.19,10.25 82.55,8.89 | IC3.16 24.66,17.45 C7.1 26.98,18.09 29.21,20.32
  Top 0.813: X2.L1.2 X2.L1.1 | 27.63,42.87 33.02,48.26 45.95,48.26 C6.1 | 51.2,51.67 54.61,48.26 85.09,48.26 91.44,54.61 91.44,63.65 | U1.6 30.96,27.46 29.21,29.21 | 29.21,29.21 29.21,36.83 29.21,40.73 L1.2 27.23,41.91 26.67,41.91 v22.86,38.1 | 29.21,29.21 29.21,20.32 29.21,12.7 29.21,6.35 31.11,4.45 31.75,3.81 49.53,3.81 63.5,3.81 77.47,3.81 83.82,3.81
  Bottom 0.813: JP3.9 JP3.10 5.94,23.27 3.81,25.4 3.81,34.29 5.08,35.56 20.32,35.56 v22.86,38.1
VCC3.3V  (via drill 0.51)
  Top 0.254: R9.2 71.95,61.4 v72.39,60.96 | v80.01,60.96 82.06,60.96 R8.2 82.5,65.99 87.63,71.12 93.98,71.12 93.98,69.85 101.6,62.23 101.37,62.23 JP1.2
  Bottom 0.254: v72.39,60.96 v80.01,60.96 | JP1.16 101.37,44.45 101.6,44.45 102.87,45.72 102.87,60.96 101.7,62.13 JP1.2
VCC5V
  Top 0.254: JP1.3 JP1.1

### Text on the board
tPlace: PWR Banana Pro | xMZ-Mod-Touch | ACCU | Sicherungen nur / durch gleichen / Wert und Typ / ersetzen! | 630mA | VCC5V | VCC3.3V | VCC5V | GND | Monitor-Batterie | Monitor-Mains | 12V | GND | RXD | GND | TXD | !MON_MAINS | VCC3.3V | LED Folie | !MON_BAT | 12V | RTS | P4 | P3 | P5 | P2 | GND | P6 | P1 | GND | GND | LED_!OE | REL_!OE | Con. Banana Pro | VCC | VCC | GND | P7 | REL_DS | LED_DS | REL_SH_CP | P8 | RS485 Modbus | LED_SH_CP | P9 | REL_ST_CP | LED_ST_CP | GND | B+ | Con. Bodenplatine | A- | BUS Terminator | Deckelplatine | v
bPlace: - | + | + | - | + | - | + | -